# EAGLE design altimeter (EAGLE 8.2.1)
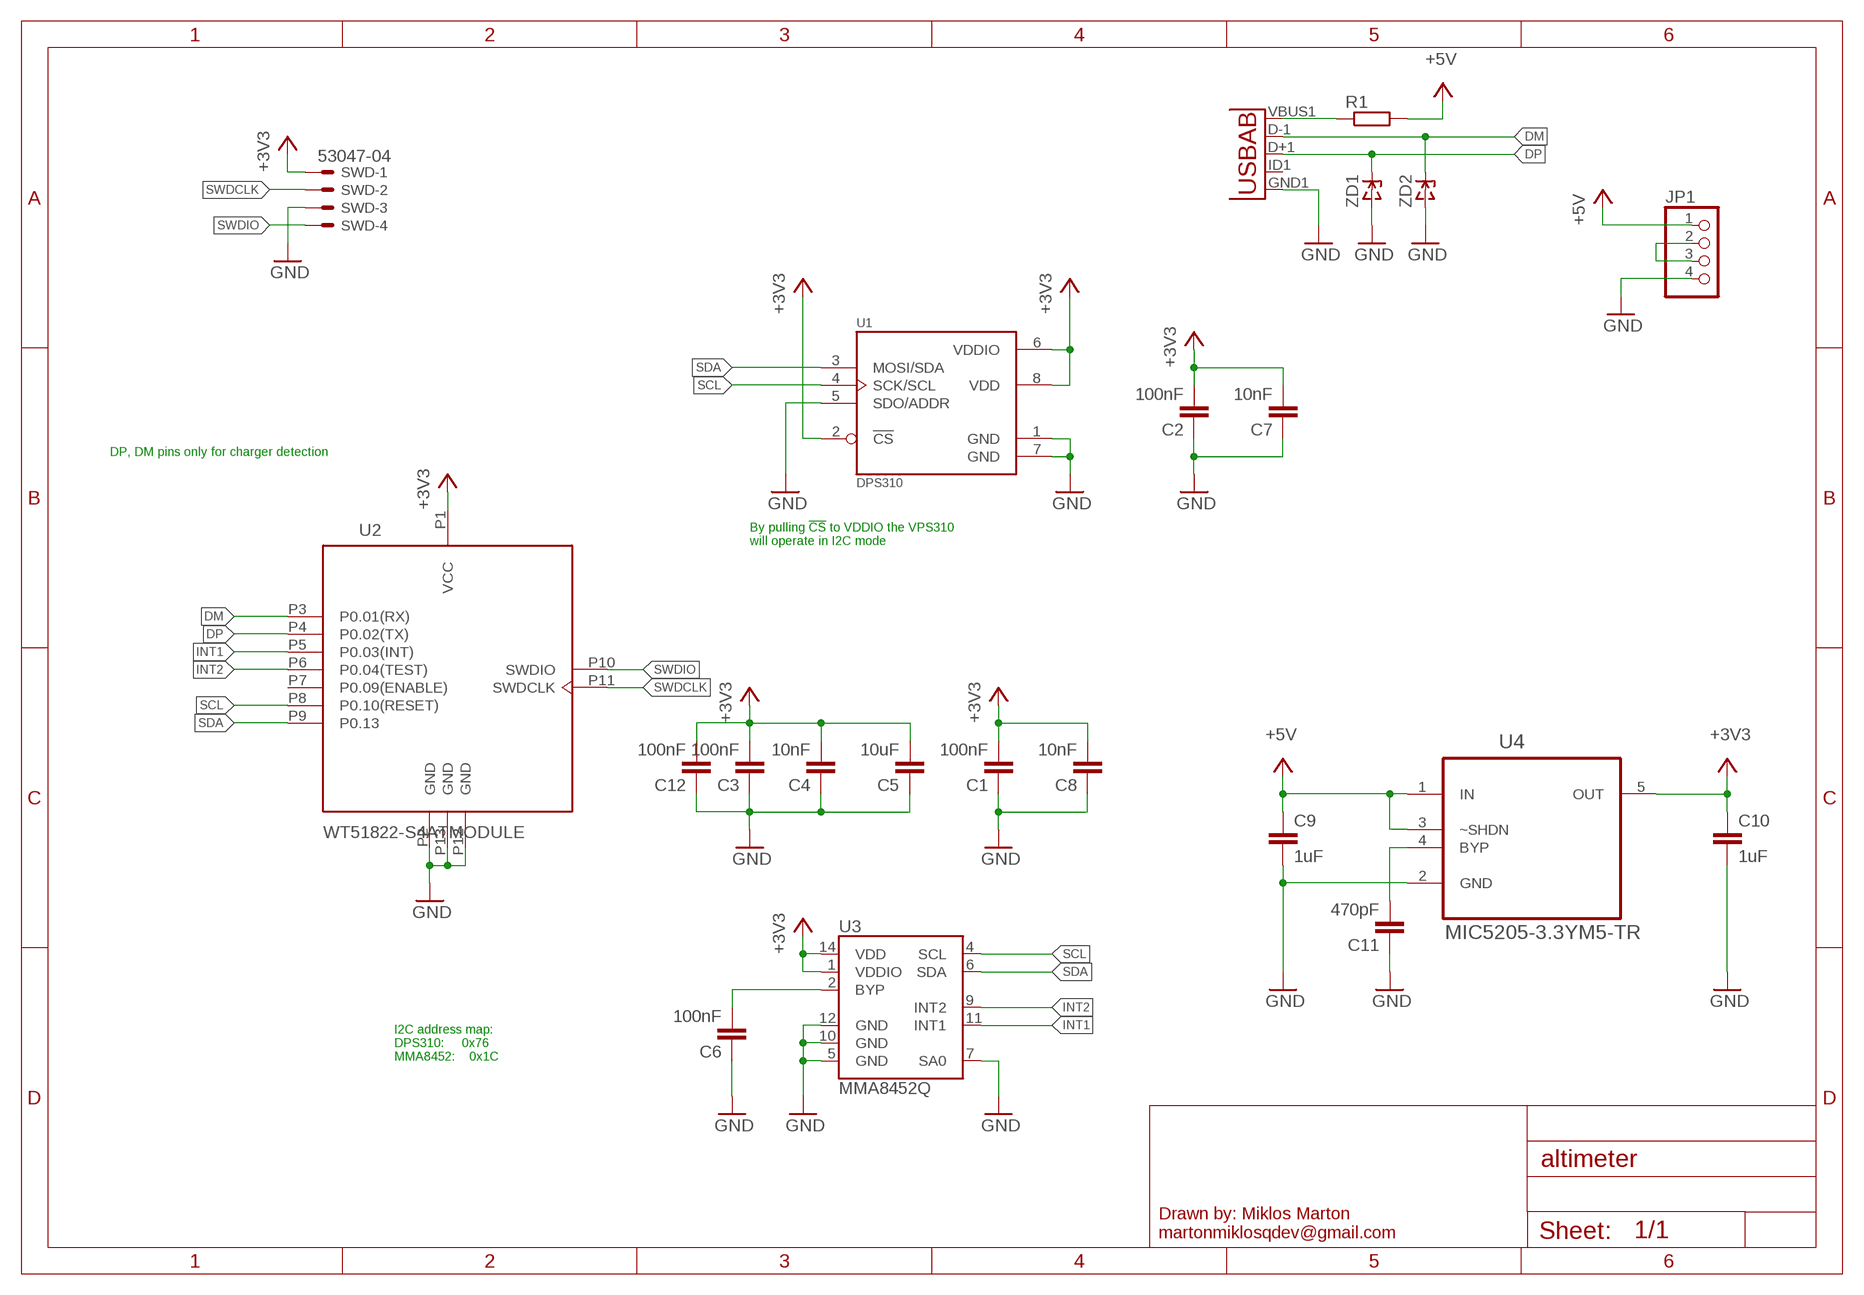
[diagram p0: schematic, sheet 1]

## Parts
C1  100nF  C-EUC0603  [C0603]
C2  100nF  C-EUC0603  [C0603]
C3  100nF  C-EUC0603  [C0603]
C4  10nF  C-EUC0603  [C0603]
C5  10uF  C-EUC0805  [C0805]
C6  100nF  C-EUC0603  [C0603]
C7  10nF  C-EUC0603  [C0603]
C8  10nF  C-EUC0603  [C0603]
C9  1uF  C-EUC0603  [C0603]
C10  1uF  C-EUC0603  [C0603]
C11  470pF  C-EUC0603  [C0603]
C12  100nF  C-EUC0603  [C0603]
JP1  PINHD-1X4  [1X04]
R1  R-EU_R0805  [R0805]
SWD  53047-04  [53047-04]
U1  DPS310  [LGA8S145X65P2X4_200X250X100]
U2  WT51822-S4ATMODULE  [WT51822-S4AT]
U3  MMA8452Q  [QFN-16_0.5MM]
U4  MIC5205-3.3YM5-TR  LT1761ES5-3.3TRMPBF  [SOT95P280X145-5N]
USB  USB-ABIN&OUT  [USB-AB-MICRO-SMD-V03-IN&OUT]
ZD1  ZENERSOD-123  [SOD-123]
ZD2  ZENERSOD-123  [SOD-123]

## Nets
+3V3: C1.2 C2.2 C3.2 C4.2 C5.2 C7.2 C8.2 C10.1 C12.2 SWD.1 U1.2(!CS) U1.6(VDDIO) U1.8(VDD) U2.P1(VCC) U3.1(VDDIO) U3.14(VDD) U4.5(OUT)
+5V: C9.1 JP1.1 R1.2 U4.1(IN) U4.3(~SHDN)
DM: U2.P3(P0.01(RX)) USB.D-1(D-) ZD2.C
DP: U2.P4(P0.02(TX)) USB.D+1(D+) ZD1.C
GND: C1.1 C2.1 C3.1 C4.1 C5.1 C6.1 C7.1 C8.1 C9.2 C10.2 C11.1 C12.1 JP1.4 SWD.3 U1.1(GND) U1.5(SDO/ADDR) U1.7(GND) U2.P2(GND) U2.P12(GND) U2.P13(GND) U3.5(GND) U3.7(SA0) U3.10(GND) U3.12(GND) U4.2(GND) USB.GND1(GND) ZD1.A ZD2.A
INT1: U2.P5(P0.03(INT)) U3.11(INT1)
INT2: U2.P6(P0.04(TEST)) U3.9(INT2)
N$1: R1.1 USB.VBUS1(VBUS)
N$2: C6.2 U3.2(BYP)
N$5: JP1.2 JP1.3
N$6: C11.2 U4.4(BYP)
SCL: U1.4(SCK/SCL) U2.P8(P0.10(RESET)) U3.4(SCL)
SDA: U1.3(MOSI/SDA) U2.P9(P0.13) U3.6(SDA)
SWDCLK: SWD.2 U2.P11(SWDCLK)
SWDIO: SWD.4 U2.P10(SWDIO)
Unconnected: U2.P7(P0.09(ENABLE)) USB.ID1(USBID)

## Notes on the sheet
- DP, DM pins only for charger detection
- By pulling !CS! to VDDIO the VPS310
  will operate in I2C mode
- I2C address map:
  DPS310:     0x76
  MMA8452:    0x1C

## Library data of the parts
C1-C12 = rcl:C-EU: CAPACITOR, European symbol
JP1 = pinhead:PINHD-1X4: PIN HEADER
R1 = rcl:R-EU_: RESISTOR, European symbol
SWD = con-molex:53?-04: CONNECTOR wire to board 1.25 mm (.049 inch) pitch header; MF: WALDOM/MOLEX; MPN: 53047-0410; OC_FARNELL: 9733060; OC_NEWARK: 38C9900
U1 = DPS310:DPS310: DPS310 Digital Barometric Pressure Sensor for Portable Devices LGA8S145X65P2X4_200X250X100
U2 = WT51822-S4AT:WT51822-S4AT: WT51822-S4AT is a high performance, low power radio transmit and receive system module use Nordic BLE 4.1 nRF51822 as the controller chips.
U3 = SparkFun:MMA8452Q: MMA8452Q 3-Axis, 12/8-bit Digital Accelerometer Supply Voltage: 1.6-3.6V Range: +/- 2g, 4g, 8g Interface: I2C, 12-bit and 8-bit ODR: 1.56 Hz - 800 Hz Package: QFN-16 http://cache.freescale.com/files/sensors/doc/data_sheet/MMA8452Q.pdf
U4 = LTC_By_element14_Batch_1:LT1761ES5-3.3TRMPBF: 100mA, Low Noise, LDO Micropower Regulators; MPN: LT1761ES5-3.3#TRMPBF; OC_FARNELL: 1663779; OC_NEWARK: 19P0920; OC_TME: MIC5205-3.3YM5-TR; PACKAGE: SOT-23-5; SUPPLIER: Linear Technology
USB = Testing:USB-AB: This is a USB AB connector that is compatible with USB OTG. i.e. this connector can serve as a host or device
ZD1 ZD2 = dp_devices:ZENER: Zener Diode SOD-323

## Board
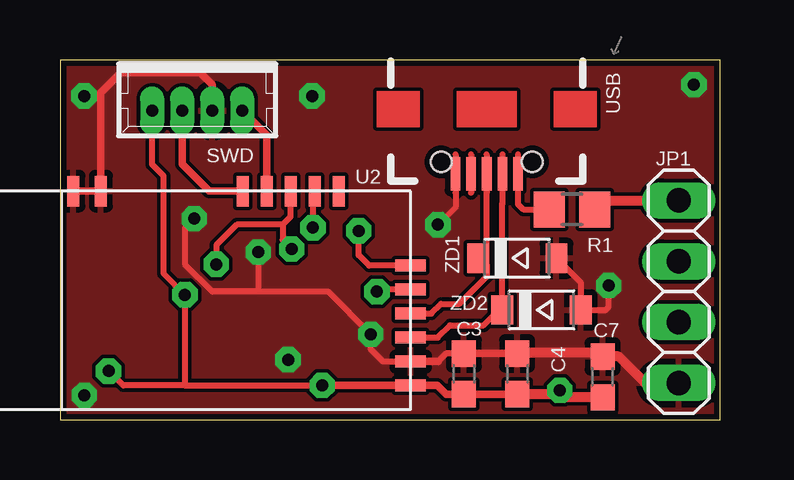
[diagram p1: board, top side]
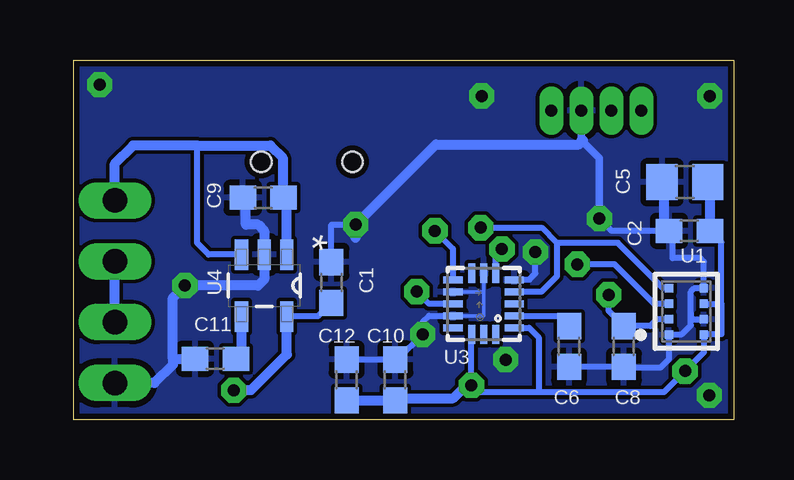
[diagram p2: board, bottom side, seen from below]

Size 27.5 x 15 mm. Coordinates in mm from the lower left corner, seen from the top.
Outline: 0,0 27.5,0 27.5,15 0,15 0,0
Copper layers (1*16): Top 0.035mm / dielectric 1.5mm / Bottom 0.035mm
Design rules "dirt_cheap_dirty_boards.v1": minimum track width 5mil, minimum drill 0.3mm, track to track 6mil, track to pad 6mil, pad to pad 6mil, via to via 6mil, smd to smd 0mil, copper to edge 10mil, drill to drill 10mil, minimum pad ring 10mil, minimum via ring 6mil, stop-mask expansion 2mil, vias tented up to drill 25mil, thermal gap 10mil

### Footprints (pad centres in the part's own frame; a part is rotated, then mirrored left to right if it is on the bottom)
C0603 = smd 1.1 x 1: 1 -0.85,0; 2 0.85,0
C0805 = smd 1.3 x 1.5: 1 -0.95,0; 2 0.95,0
1X04 = drill 1.016 long: 1 -3.81,0; 2 -1.27,0; 3 1.27,0; 4 3.81,0
R0805 = smd 1.3 x 1.5: 1 -0.95,0; 2 0.95,0
53047-04 = drill 0.5 pad 0.698 long: 1 1.875,0.45; 2 0.625,0.45; 3 -0.625,0.45; 4 -1.875,0.45
LGA8S145X65P2X4_200X250X100 = smd 0.35 x 0.35: 1 -0.975,0.725; 2 -0.325,0.725; 3 0.325,0.725; 4 0.975,0.725; 5 0.975,-0.725; 6 0.325,-0.725; 7 -0.325,-0.725; 8 -0.975,-0.725
WT51822-S4AT = smd 1.27 x 0.5: P1 0,8.1; P2 0,7.1; P3 0,6.1; P4 0,5.1; P5 0,4.1; P6 0,3.1 | smd 0.5 x 1.27: P7 3,0; P8 4,0; P9 5,0; P10 6,0; P11 7,0; P12 12.9,0; P13 14.05,0
QFN-16_0.5MM = smd 0.8 x 0.3: 1 -1.275,1; 2 -1.275,0.5; 3 -1.275,0; 4 -1.275,-0.5; 5 -1.275,-1; 9 1.275,-1; 10 1.275,-0.5; 11 1.275,0; 12 1.275,0.5; 13 1.275,1 | smd 0.3 x 0.8: 6 -0.5,-1.275; 7 0,-1.275; 8 0.5,-1.275; 14 0.5,1.275; 15 0,1.275; 16 -0.5,1.275
SOT95P280X145-5N = smd 1.27 x 0.559: 1 -1.295,0.94; 2 -1.295,0; 3 -1.295,-0.94; 4 1.295,-0.94; 5 1.295,0.94
USB-AB-MICRO-SMD-V03-IN&OUT = smd 1.4 x 0.4: D+1 2.7,0; D-1 2.7,0.65; GND1 2.7,-1.3; ID1 2.7,-0.65; VBUS1 2.7,1.3 | hole 0.85: 2.2,1.9; 2.2,-1.9
SOD-123 = smd 0.91 x 1.22: A 1.635,0; C -1.635,0

### Placement (x,y rotation side)
C1  16.76,5.71 270 bottom
C2  1.84,7.87 0 bottom
C3  16.83,1.91 270 top
C4  19.05,1.91 270 top
C5  2.03,9.91 0 bottom
C6  6.86,3.05 90 bottom
C7  22.61,1.78 270 top
C8  4.57,3.05 90 bottom
C9  19.6,9.25 180 bottom
C10  14.1,1.65 90 bottom
C11  21.59,2.54 0 bottom
C12  16.13,1.65 270 bottom
JP1  25.78,5.33 270 top
R1  21.34,8.76 0 top
SWD  5.71,13.34 180 top
U1  1.97,4.51 90 bottom
U2  14.61,9.53 180 top
U3  10.41,4.83 180 bottom
U4  19.56,5.59 270 bottom
USB  17.78,12.95 270 top
ZD1  19.05,6.73 0 top
ZD2  20.07,4.57 0 top

### Tracks (layer width: path | path; a pad name or v marks a point on that pad's centre or on a via)
+3V3  (via drill 0.5 pad 1.05)
  Top 0.254: 5.21,1.43 2.64,1.43 v2.02,2.02 | 5.21,1.43 v10.92,1.43 | SWD.1 3.84,10.64 4.32,10.16 4.32,6.1 v5.21,5.21 5.21,1.43
  Top 0.305: C4.2 C3.2 16.09,1.05 15.72,1.43 U2.P1 v10.92,1.43
  Top 0.406: 20.66,1.05 C4.2 | 20.66,1.05 v20.83,1.22 | C7.2 20.79,0.93 arc-90 20.66,1.05
  Bottom 0.254: U3.14 10.92,3.54 v10.92,1.43 10.95,1.43 10.67,1.14 8.13,1.14 | 9.12,3.81 U3.1 8.53,3.83 8.13,3.43 8.13,1.14 | U1.6 0.51,4.83 | 0.51,4.83 0.51,3.56 1.22,3.56 U1.8 1.24,2.8 v2.02,2.02 2.9,1.14 8.13,1.14 | U1.2 2.7,4.19 3.17,4.19 3.47,3.9 C8.2 5.21,4.53 v5.21,5.21 | 0.51,4.83 0.51,7.39 C2.2 | U4.5 18.62,4.32 17.31,4.32 C1.2
  Bottom 0.406: U4.5 18.62,2.72 20.12,1.22 v20.83,1.22 | C5.2 0.99,9.82 C2.2 | C12.2 C10.1 14.01,0.89 11.68,0.89 11.15,1.43 10.95,1.43
+5V
  Top 0.254: R1.2 22.41,8.7 22.86,9.14
  Top 0.406: 22.86,9.14 JP1.1
  Bottom 0.254: U4.3 21.87,6.88 22.35,7.37 22.35,11.43
  Bottom 0.406: U4.1 18.62,9.12 C9.1 18.8,9.3 18.8,10.92 19.3,11.43 22.35,11.43 25.02,11.43 25.78,10.67 JP1.1
DM
  Top 0.254: U2.P3 15.74,3.42 16.26,3.94 17.65,3.94 18.41,4.7 | 18.41,4.7 18.41,8.99 18.43,9.01 USB.D-1 | ZD2.C 18.43,4.68 18.41,4.7
DP
  Top 0.254: U2.P4 15.47,4.42 15.88,4.83 16.64,4.83 17.78,5.97 17.78,6.48 | 17.78,6.48 USB.D+1 | ZD1.C 17.53,6.73 17.78,6.48
GND  (via drill 0.5 pad 1.05)
  Top 0.254: v15.75,8.13 16.48,8.86 USB.GND1 | v5.59,8.38 5.21,8 5.21,6.48 6.35,5.33 8.26,5.33 | 8.26,5.33 11.18,5.33 v12.95,3.56 12.95,2.92 13.46,2.41 14.59,2.41 U2.P2 | v8.26,6.99 8.26,5.33 | ZD1.A 21.7,5.71 ZD2.A 22.73,4.57 22.86,4.7 v22.86,5.59 | C3.1 16.09,2.75 15.76,2.42
  Top 0.305: C4.1 C3.1 | 15.76,2.42 U2.P2 | U2.P13 U2.P12 1.71,13.64 2.54,14.48 5.84,14.48 6.35,13.97 SWD.3
  Top 0.406: C4.1 19.09,2.79 22.44,2.79 arc-90 C7.1 23.28,2.63 24.38,1.52 JP1.4
  Bottom 0.152: U3.12 10.42,4.33 10.41,4.32 10.41,5.33 | U3.7 10.41,5.33 | U3.10 10.42,5.33 10.41,5.33
  Bottom 0.254: U3.12 12.69,4.33 12.95,4.06 v12.95,3.56 14.01,2.5 C10.2 C12.1 | U1.5 1.27,5.46 1.65,5.46 1.78,5.33 1.78,4.45 | 1.78,4.45 1.77,4.18 U1.7 | 1.78,4.45 1.78,3.94 2.16,3.56 2.67,3.56 U1.1 2.69,2.51 3.05,2.16 4.53,2.16 C8.1 C6.1 | U1.5 1.27,5.51 | U1.5 1.24,6.58 1.4,6.73 2.54,6.73 2.54,7.72 C2.1 2.92,7.87 5.08,7.87 v5.59,8.38 | U3.5 9.12,5.84 8.51,5.84 8.26,6.1 v8.26,6.99 | C1.1 16.76,8.13 v15.75,8.13
  Bottom 0.305: v5.59,8.38 5.59,10.9 6.34,11.65 SWD.3
  Bottom 0.406: C9.2 20.32,9.12 20.32,8.13 19.81,8.13 19.56,7.87 U4.2 19.56,5.84 19.81,5.59 v22.86,5.59 23.37,5.08 23.37,2.54 | 6.34,11.65 6.27,11.65 6.45,11.47 12.4,11.47 v15.75,8.13 15.75,7.58 | 23.37,2.54 23.37,2.29 24.13,1.52 JP1.4 | 23.37,2.54 C11.1 | C5.1 2.92,9.85 2.92,7.87
  other vias: 9.5,2.5 1,13.5 10.5,13.5 1.02,1.02 26.42,13.97
  pour Top: 0,15 27.5,15 27.5,0 0,0
  pour Bottom: 0,15 27.5,15 27.5,0 0,0
INT1  (via drill 0.5 pad 1.05)
  Top 0.254: U2.P5 13.3,5.42 v13.21,5.33
  Bottom 0.254: U3.11 12.7,4.83 v13.21,5.33
INT2  (via drill 0.5 pad 1.05)
  Top 0.254: U2.P6 12.88,6.42 12.45,6.86 v12.45,7.87
  Bottom 0.254: U3.9 11.69,7.12 v12.45,7.87
N$1
  Top 0.254: USB.VBUS1 19.08,8.99 19.3,8.76 R1.1
N$2
  Bottom 0.254: U3.2 7.29,4.33 C6.2
N$5
  Bottom 0.406: JP1.3 JP1.2
N$6
  Bottom 0.406: C11.2 20.5,2.78 U4.4
SCL  (via drill 0.5 pad 1.05)
  Top 0.254: U2.P8 10.54,9.46 v10.54,8
  Bottom 0.254: 2.72,5.46 U1.4 2.94,5.48 4.83,7.37 7.37,7.37 | U3.4 9.12,5.35 | U3.4 | 7.37,7.37 8,8 v10.54,8 | 7.37,7.37 7.37,5.97 8.01,5.33 U3.4
SDA  (via drill 0.5 pad 1.05)
  Top 0.254: 9.27,8.13 7.37,8.13 6.51,7.27 v6.51,6.48 | 9.27,8.13 9.61,8.46 U2.P9 | 9.27,8.13 9.27,7.49 v9.65,7.11
  Bottom 0.254: U1.3 2.7,4.83 3.3,4.83 4.95,6.48 v6.51,6.48 | U3.6 9.91,6.85 v9.65,7.11
SWDCLK
  Top 0.305: U2.P11 6.22,9.53 5.09,10.66 SWD.2
SWDIO
  Top 0.305: SWD.4 8.61,11.87 U2.P10